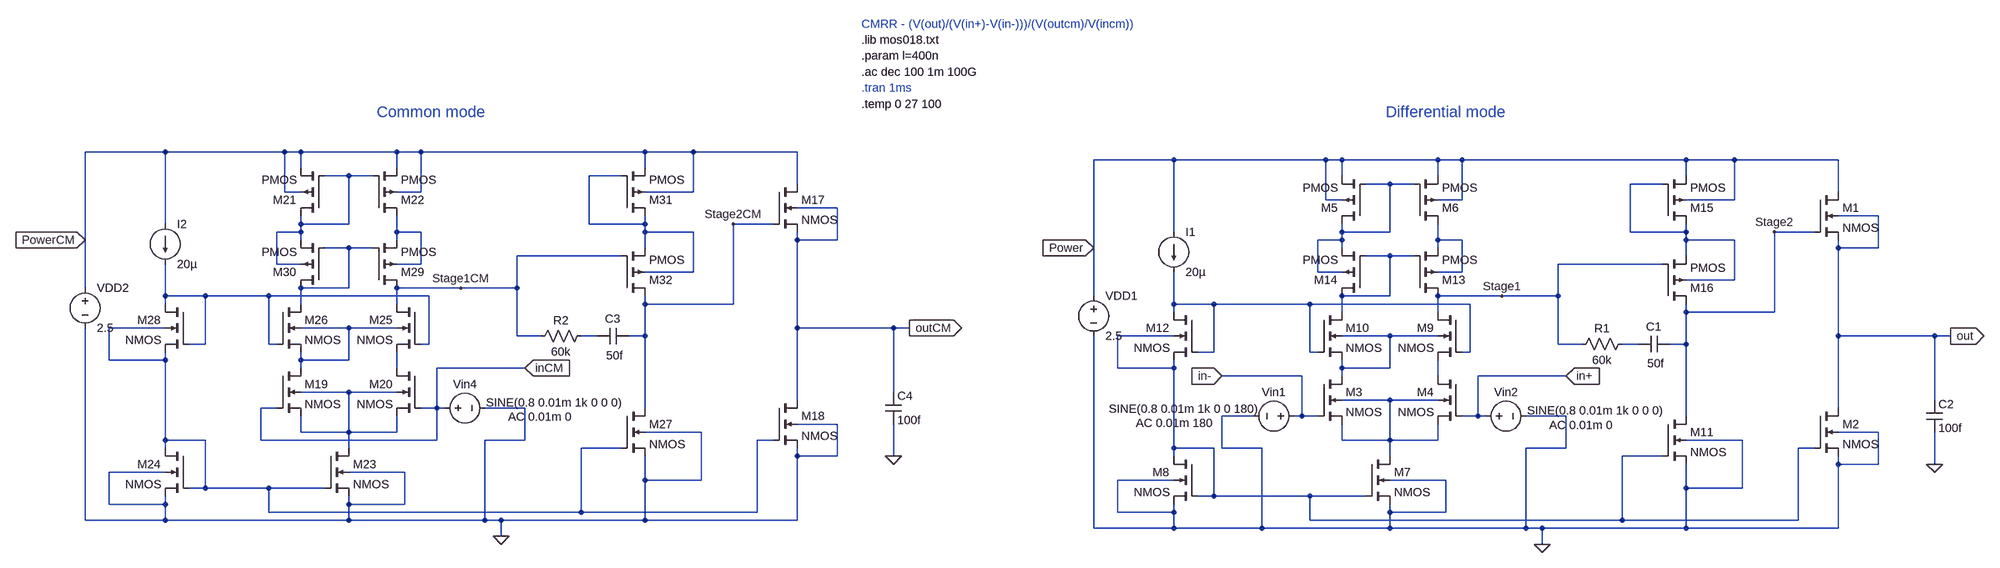
[diagram p0: schematic CMRR.asc]
CMRR.asc, the LTspice schematic file:
Version 4
SHEET 1 1324 1444
WIRE -2576 -240 -2736 -240
WIRE -2272 -240 -2576 -240
WIRE -2240 -240 -2272 -240
WIRE -2048 -240 -2240 -240
WIRE -2000 -240 -2048 -240
WIRE -1552 -240 -2000 -240
WIRE -1456 -240 -1552 -240
WIRE -1248 -240 -1456 -240
WIRE -496 -224 -656 -224
WIRE -192 -224 -496 -224
WIRE -160 -224 -192 -224
WIRE 32 -224 -160 -224
WIRE 80 -224 32 -224
WIRE 528 -224 80 -224
WIRE 624 -224 528 -224
WIRE 832 -224 624 -224
WIRE -2240 -208 -2240 -240
WIRE -2048 -208 -2048 -240
WIRE -1552 -208 -1552 -240
WIRE -2144 -192 -2192 -192
WIRE -2096 -192 -2144 -192
WIRE -1600 -192 -1664 -192
WIRE -160 -192 -160 -224
WIRE 32 -192 32 -224
WIRE 528 -192 528 -224
WIRE -1248 -176 -1248 -240
WIRE -64 -176 -112 -176
WIRE -16 -176 -64 -176
WIRE 480 -176 416 -176
WIRE -2272 -160 -2272 -240
WIRE -2240 -160 -2272 -160
WIRE -2000 -160 -2000 -240
WIRE -2000 -160 -2048 -160
WIRE -1456 -160 -1456 -240
WIRE -1456 -160 -1552 -160
WIRE 832 -160 832 -224
WIRE -192 -144 -192 -224
WIRE -160 -144 -192 -144
WIRE 80 -144 80 -224
WIRE 80 -144 32 -144
WIRE 624 -144 624 -224
WIRE 624 -144 528 -144
WIRE -1168 -128 -1248 -128
WIRE 912 -112 832 -112
WIRE -2576 -96 -2576 -240
WIRE -2240 -96 -2240 -112
WIRE -2144 -96 -2144 -192
WIRE -2144 -96 -2240 -96
WIRE -1664 -96 -1664 -192
WIRE -1552 -96 -1552 -112
WIRE -1552 -96 -1664 -96
WIRE -1296 -96 -1376 -96
WIRE -2240 -80 -2240 -96
WIRE -2240 -80 -2288 -80
WIRE -2048 -80 -2048 -112
WIRE -2000 -80 -2048 -80
WIRE -1552 -80 -1552 -96
WIRE -1456 -80 -1552 -80
WIRE -496 -80 -496 -224
WIRE -160 -80 -160 -96
WIRE -64 -80 -64 -176
WIRE -64 -80 -160 -80
WIRE 416 -80 416 -176
WIRE 528 -80 528 -96
WIRE 528 -80 416 -80
WIRE 784 -80 704 -80
WIRE -2736 -64 -2736 -240
WIRE -2240 -64 -2240 -80
WIRE -2048 -64 -2048 -80
WIRE -1248 -64 -1248 -80
WIRE -1168 -64 -1168 -128
WIRE -1168 -64 -1248 -64
WIRE -160 -64 -160 -80
WIRE -160 -64 -208 -64
WIRE 32 -64 32 -96
WIRE 80 -64 32 -64
WIRE 528 -64 528 -80
WIRE 624 -64 528 -64
WIRE -2144 -48 -2192 -48
WIRE -2096 -48 -2144 -48
WIRE -1552 -48 -1552 -80
WIRE -656 -48 -656 -224
WIRE -160 -48 -160 -64
WIRE 32 -48 32 -64
WIRE 832 -48 832 -64
WIRE 912 -48 912 -112
WIRE 912 -48 832 -48
WIRE -1600 -32 -1808 -32
WIRE -64 -32 -112 -32
WIRE -16 -32 -64 -32
WIRE 528 -32 528 -64
WIRE -2288 -16 -2288 -80
WIRE -2240 -16 -2288 -16
WIRE -2000 -16 -2000 -80
WIRE -2000 -16 -2048 -16
WIRE 480 -16 272 -16
WIRE -1456 0 -1456 -80
WIRE -1456 0 -1552 0
WIRE -208 0 -208 -64
WIRE -160 0 -208 0
WIRE 80 0 80 -64
WIRE 80 0 32 0
WIRE 624 16 624 -64
WIRE 624 16 528 16
WIRE -2736 32 -2736 -64
WIRE -2144 32 -2144 -48
WIRE -2144 32 -2240 32
WIRE -1920 32 -2048 32
WIRE -1808 32 -1808 -32
WIRE -1808 32 -1920 32
WIRE -2576 48 -2576 -16
WIRE -2496 48 -2576 48
WIRE -2304 48 -2496 48
WIRE -1984 48 -2304 48
WIRE -656 48 -656 -48
WIRE -64 48 -64 -32
WIRE -64 48 -160 48
WIRE 160 48 32 48
WIRE 272 48 272 -16
WIRE 272 48 160 48
WIRE -2576 64 -2576 48
WIRE -2240 64 -2240 32
WIRE -2048 64 -2048 32
WIRE -1552 64 -1552 48
WIRE -1376 64 -1376 -96
WIRE -1376 64 -1552 64
WIRE -496 64 -496 0
WIRE -416 64 -496 64
WIRE -224 64 -416 64
WIRE 96 64 -224 64
WIRE -496 80 -496 64
WIRE -160 80 -160 48
WIRE 32 80 32 48
WIRE 528 80 528 64
WIRE 704 80 704 -80
WIRE 704 80 528 80
WIRE -2576 112 -2688 112
WIRE -2144 112 -2240 112
WIRE -2048 112 -2144 112
WIRE -1248 112 -1248 -64
WIRE -1056 112 -1248 112
WIRE -1024 112 -1056 112
WIRE -1808 128 -1808 32
WIRE -1760 128 -1808 128
WIRE -1648 128 -1680 128
WIRE -1552 128 -1552 64
WIRE -1552 128 -1584 128
WIRE -496 128 -608 128
WIRE -64 128 -160 128
WIRE 32 128 -64 128
WIRE 832 128 832 -48
WIRE 1024 128 832 128
WIRE 1056 128 1024 128
WIRE -2496 144 -2496 48
WIRE -2496 144 -2528 144
WIRE -2304 144 -2304 48
WIRE -2288 144 -2304 144
WIRE -1984 144 -1984 48
WIRE -1984 144 -2000 144
WIRE 272 144 272 48
WIRE 320 144 272 144
WIRE 432 144 400 144
WIRE 528 144 528 80
WIRE 528 144 496 144
WIRE -416 160 -416 64
WIRE -416 160 -448 160
WIRE -224 160 -224 64
WIRE -208 160 -224 160
WIRE 96 160 96 64
WIRE 96 160 80 160
WIRE -2688 176 -2688 112
WIRE -2576 176 -2576 160
WIRE -2576 176 -2688 176
WIRE -2240 176 -2240 160
WIRE -2144 176 -2144 112
WIRE -2144 176 -2240 176
WIRE -2240 192 -2240 176
WIRE -2048 192 -2048 160
WIRE -1792 192 -1968 192
WIRE -608 192 -608 128
WIRE -496 192 -496 176
WIRE -496 192 -608 192
WIRE -160 192 -160 176
WIRE -64 192 -64 128
WIRE -64 192 -160 192
WIRE -240 208 -400 208
WIRE -160 208 -160 192
WIRE 32 208 32 176
WIRE 288 208 112 208
WIRE -2144 240 -2240 240
WIRE -2048 240 -2144 240
WIRE -1056 240 -1056 112
WIRE -1248 256 -1248 112
WIRE -64 256 -160 256
WIRE 32 256 -64 256
WIRE 1024 256 1024 128
WIRE -2288 272 -2320 272
WIRE -1968 272 -1968 192
WIRE -1968 272 -2000 272
WIRE -1952 272 -1968 272
WIRE -1792 272 -1872 272
WIRE -1552 272 -1552 128
WIRE 832 272 832 128
WIRE -336 288 -400 288
WIRE -240 288 -240 208
WIRE -240 288 -256 288
WIRE -208 288 -240 288
WIRE 112 288 112 208
WIRE 112 288 80 288
WIRE 128 288 112 288
WIRE 288 288 208 288
WIRE 528 288 528 144
WIRE -1168 304 -1248 304
WIRE -2240 320 -2240 288
WIRE -2144 320 -2144 240
WIRE -2144 320 -2240 320
WIRE -2048 320 -2048 288
WIRE -2048 320 -2144 320
WIRE -1440 320 -1552 320
WIRE 912 320 832 320
WIRE -2576 336 -2576 176
WIRE -2496 336 -2576 336
WIRE -2320 336 -2320 272
WIRE -1968 336 -1968 272
WIRE -1968 336 -2320 336
WIRE -1792 336 -1792 272
WIRE -1792 336 -1872 336
WIRE -1296 336 -1328 336
WIRE -160 336 -160 304
WIRE -64 336 -64 256
WIRE -64 336 -160 336
WIRE 32 336 32 304
WIRE 32 336 -64 336
WIRE 640 336 528 336
WIRE -2576 352 -2576 336
WIRE -2144 352 -2144 320
WIRE -1600 352 -1680 352
WIRE -496 352 -496 192
WIRE -416 352 -496 352
WIRE -400 352 -400 288
WIRE -320 352 -400 352
WIRE 288 352 288 288
WIRE 288 352 208 352
WIRE 784 352 752 352
WIRE -1248 368 -1248 352
WIRE -1168 368 -1168 304
WIRE -1168 368 -1248 368
WIRE -1056 368 -1056 304
WIRE -496 368 -496 352
WIRE -64 368 -64 336
WIRE 480 368 400 368
WIRE 832 384 832 368
WIRE 912 384 912 320
WIRE 912 384 832 384
WIRE 1024 384 1024 320
WIRE -2576 400 -2688 400
WIRE -2032 400 -2144 400
WIRE -1552 416 -1552 368
WIRE -1440 416 -1440 320
WIRE -1440 416 -1552 416
WIRE -496 416 -608 416
WIRE 48 416 -64 416
WIRE -2496 432 -2496 336
WIRE -2496 432 -2528 432
WIRE -2304 432 -2496 432
WIRE -2192 432 -2304 432
WIRE 528 432 528 384
WIRE 640 432 640 336
WIRE 640 432 528 432
WIRE -416 448 -416 352
WIRE -416 448 -448 448
WIRE -224 448 -416 448
WIRE -112 448 -224 448
WIRE -2688 464 -2688 400
WIRE -2576 464 -2576 448
WIRE -2576 464 -2688 464
WIRE -2144 464 -2144 448
WIRE -2032 464 -2032 400
WIRE -2032 464 -2144 464
WIRE -2304 480 -2304 432
WIRE -1680 480 -1680 352
WIRE -1680 480 -2304 480
WIRE -1328 480 -1328 336
WIRE -1328 480 -1680 480
WIRE -608 480 -608 416
WIRE -496 480 -496 464
WIRE -496 480 -608 480
WIRE -64 480 -64 464
WIRE 48 480 48 416
WIRE 48 480 -64 480
WIRE -2736 496 -2736 112
WIRE -2576 496 -2576 464
WIRE -2576 496 -2736 496
WIRE -2144 496 -2144 464
WIRE -2144 496 -2576 496
WIRE -1872 496 -1872 336
WIRE -1872 496 -2144 496
WIRE -1840 496 -1872 496
WIRE -1552 496 -1552 416
WIRE -1552 496 -1840 496
WIRE -1248 496 -1248 368
WIRE -1248 496 -1552 496
WIRE -224 496 -224 448
WIRE 400 496 400 368
WIRE 400 496 -224 496
WIRE 752 496 752 352
WIRE 752 496 400 496
WIRE -656 512 -656 128
WIRE -496 512 -496 480
WIRE -496 512 -656 512
WIRE -320 512 -320 352
WIRE -320 512 -496 512
WIRE -64 512 -64 480
WIRE -64 512 -320 512
WIRE 208 512 208 352
WIRE 208 512 -64 512
WIRE 240 512 208 512
WIRE 528 512 528 432
WIRE 528 512 240 512
WIRE 832 512 832 384
WIRE 832 512 528 512
WIRE -1840 528 -1840 496
WIRE 240 544 240 512
FLAG 1056 128 out
IOPIN 1056 128 Out
FLAG 240 544 0
FLAG 288 208 in+
IOPIN 288 208 In
FLAG -400 208 in-
IOPIN -400 208 In
FLAG 160 48 Stage1
FLAG 704 -80 Stage2
FLAG -656 -48 Power
IOPIN -656 -48 In
FLAG 1024 384 0
FLAG -1024 112 outCM
IOPIN -1024 112 Out
FLAG -1840 528 0
FLAG -1792 192 inCM
IOPIN -1792 192 In
FLAG -1920 32 Stage1CM
FLAG -1376 -96 Stage2CM
FLAG -2736 -64 PowerCM
IOPIN -2736 -64 In
FLAG -1056 368 0
SYMBOL nmos4 784 -160 R0
SYMATTR InstName M1
SYMATTR Value2 l={l} w=0.5u m=20
SYMBOL nmos4 784 272 R0
SYMATTR InstName M2
SYMATTR Value2 l={l} w=10u m=3
SYMBOL nmos4 -208 208 R0
SYMATTR InstName M3
SYMATTR Value2 l={l} w=0.5u m=1
SYMBOL nmos4 80 208 M0
SYMATTR InstName M4
SYMATTR Value2 l={l} w=0.5u m=1
SYMBOL pmos4 -112 -96 R180
SYMATTR InstName M5
SYMATTR Value2 l={l} w=1u m=2
SYMBOL pmos4 -16 -96 M180
SYMATTR InstName M6
SYMATTR Value2 l={l} w=1u m=2
SYMBOL nmos4 -112 368 R0
SYMATTR InstName M7
SYMATTR Value2 l={l} w=2u
SYMBOL current -496 -80 R0
WINDOW 123 0 0 Left 0
WINDOW 39 0 0 Left 0
SYMATTR InstName I1
SYMATTR Value 20µ
SYMBOL nmos4 -448 368 M0
SYMATTR InstName M8
SYMATTR Value2 l={l} w=10u
SYMBOL voltage -656 32 R0
WINDOW 123 0 0 Left 0
WINDOW 39 0 0 Left 0
SYMATTR InstName VDD1
SYMATTR Value 2.5
SYMBOL voltage -240 288 R90
WINDOW 0 -32 56 VBottom 2
WINDOW 3 -30 236 VTop 2
WINDOW 123 -2 254 VTop 2
WINDOW 39 -2 236 VTop 2
SYMATTR InstName Vin1
SYMATTR Value SINE(0.8 0.01m 1k 0 0 180)
SYMATTR Value2 AC 0.01m 180
SYMBOL voltage 112 288 R270
WINDOW 0 32 56 VTop 2
WINDOW 3 27 235 VBottom 2
WINDOW 123 -2 206 VBottom 2
WINDOW 39 -1 235 VBottom 2
SYMATTR InstName Vin2
SYMATTR Value SINE(0.8 0.01m 1k 0 0 0)
SYMATTR Value2 AC 0.01m 0
SYMBOL nmos4 80 80 M0
SYMATTR InstName M9
SYMATTR Value2 l={l} w=0.5u m=1
SYMBOL nmos4 -208 80 R0
SYMATTR InstName M10
SYMATTR Value2 l={l} w=0.5u m=1
SYMBOL nmos4 480 288 R0
SYMATTR InstName M11
SYMATTR Value2 l={l} w=1u m=5
SYMBOL cap 496 128 R90
WINDOW 0 -3 33 VBottom 2
WINDOW 3 39 29 VTop 2
SYMATTR InstName C1
SYMATTR Value 50f
SYMBOL nmos4 -448 80 M0
SYMATTR InstName M12
SYMATTR Value2 l={l} w=1u
SYMBOL pmos4 -16 48 M180
SYMATTR InstName M13
SYMATTR Value2 l={l} w=1u m=1
SYMBOL pmos4 -112 48 R180
SYMATTR InstName M14
SYMATTR Value2 l={l} w=1u m=1
SYMBOL pmos4 480 -96 M180
SYMATTR InstName M15
SYMATTR Value2 l={l} w=0.5u m=25
SYMBOL pmos4 480 64 M180
SYMATTR InstName M16
SYMATTR Value2 l={l} w=0.5u m=10
SYMBOL res 416 128 R90
WINDOW 0 0 56 VBottom 2
WINDOW 3 32 56 VTop 2
SYMATTR InstName R1
SYMATTR Value 60k
SYMBOL cap 1008 256 R0
SYMATTR InstName C2
SYMATTR Value 100f
SYMBOL nmos4 -1296 -176 R0
SYMATTR InstName M17
SYMATTR Value2 l={l} w=0.5u m=20
SYMBOL nmos4 -1296 256 R0
SYMATTR InstName M18
SYMATTR Value2 l={l} w=10u m=3
SYMBOL nmos4 -2288 192 R0
SYMATTR InstName M19
SYMATTR Value2 l={l} w=0.5u m=1
SYMBOL nmos4 -2000 192 M0
SYMATTR InstName M20
SYMATTR Value2 l={l} w=0.5u m=1
SYMBOL pmos4 -2192 -112 R180
SYMATTR InstName M21
SYMATTR Value2 l={l} w=1u m=2
SYMBOL pmos4 -2096 -112 M180
SYMATTR InstName M22
SYMATTR Value2 l={l} w=1u m=2
SYMBOL nmos4 -2192 352 R0
SYMATTR InstName M23
SYMATTR Value2 l={l} w=2u
SYMBOL current -2576 -96 R0
WINDOW 123 0 0 Left 0
WINDOW 39 0 0 Left 0
SYMATTR InstName I2
SYMATTR Value 20µ
SYMBOL nmos4 -2528 352 M0
SYMATTR InstName M24
SYMATTR Value2 l={l} w=10u
SYMBOL voltage -2736 16 R0
WINDOW 123 0 0 Left 0
WINDOW 39 0 0 Left 0
SYMATTR InstName VDD2
SYMATTR Value 2.5
SYMBOL voltage -1968 272 R270
WINDOW 0 32 56 VTop 2
WINDOW 3 27 235 VBottom 2
WINDOW 123 -2 206 VBottom 2
WINDOW 39 -1 235 VBottom 2
SYMATTR InstName Vin4
SYMATTR Value SINE(0.8 0.01m 1k 0 0 0)
SYMATTR Value2 AC 0.01m 0
SYMBOL nmos4 -2000 64 M0
SYMATTR InstName M25
SYMATTR Value2 l={l} w=0.5u m=1
SYMBOL nmos4 -2288 64 R0
SYMATTR InstName M26
SYMATTR Value2 l={l} w=0.5u m=1
SYMBOL nmos4 -1600 272 R0
SYMATTR InstName M27
SYMATTR Value2 l={l} w=1u m=5
SYMBOL cap -1584 112 R90
WINDOW 0 -3 33 VBottom 2
WINDOW 3 39 29 VTop 2
SYMATTR InstName C3
SYMATTR Value 50f
SYMBOL nmos4 -2528 64 M0
SYMATTR InstName M28
SYMATTR Value2 l={l} w=1u
SYMBOL pmos4 -2096 32 M180
SYMATTR InstName M29
SYMATTR Value2 l={l} w=1u m=1
SYMBOL pmos4 -2192 32 R180
SYMATTR InstName M30
SYMATTR Value2 l={l} w=1u m=1
SYMBOL pmos4 -1600 -112 M180
SYMATTR InstName M31
SYMATTR Value2 l={l} w=0.5u m=25
SYMBOL pmos4 -1600 48 M180
SYMATTR InstName M32
SYMATTR Value2 l={l} w=0.5u m=10
SYMBOL res -1664 112 R90
WINDOW 0 0 56 VBottom 2
WINDOW 3 32 56 VTop 2
SYMATTR InstName R2
SYMATTR Value 60k
SYMBOL cap -1072 240 R0
SYMATTR InstName C4
SYMATTR Value 100f
TEXT -1120 -368 Left 2 ;.tran 1ms
TEXT -1120 -336 Left 2 !.temp 0 27 100
TEXT -1120 -400 Left 2 !.ac dec 100 1m 100G
TEXT -1120 -432 Left 2 !.param l=400n
TEXT -1120 -464 Left 2 !.lib mos018.txt
TEXT -1120 -496 Left 2 ;CMRR - (V(out)/(V(in+)-V(in-)))/(V(outcm)/V(incm))
TEXT -72 -320 Left 3 ;Differential mode
TEXT -2088 -320 Left 3 ;Common mode

The netlist it stands for:
* CMRR.asc
M1 Power Stage2 out out NMOS l={l} w=0.5u m=20
M2 out N014 0 0 NMOS l={l} w=10u m=3
M3 N015 in- N020 N020 NMOS l={l} w=0.5u m=1
M4 N018 in+ N020 N020 NMOS l={l} w=0.5u m=1
M5 N003 N003 Power Power PMOS l={l} w=1u m=2
M6 N006 N003 Power Power PMOS l={l} w=1u m=2
M7 N020 N014 0 0 NMOS l={l} w=2u
I1 Power N010 20µ
M8 N014 N014 0 0 NMOS l={l} w=10u
VDD1 Power 0 2.5
Vin1 in- 0 SINE(0.8 0.01m 1k 0 0 180) AC 0.01m 180
Vin2 in+ 0 SINE(0.8 0.01m 1k 0 0 0) AC 0.01m 0
M9 Stage1 N010 N018 N015 NMOS l={l} w=0.5u m=1
M10 N008 N010 N015 N015 NMOS l={l} w=0.5u m=1
M11 Stage2 N014 0 0 NMOS l={l} w=1u m=5
C1 Stage2 N016 50f
M12 N010 N010 N014 N014 NMOS l={l} w=1u
M13 Stage1 N008 N006 N006 PMOS l={l} w=1u m=1
M14 N008 N008 N003 N003 PMOS l={l} w=1u m=1
M15 N004 N004 Power Power PMOS l={l} w=0.5u m=25
M16 Stage2 Stage1 N004 N004 PMOS l={l} w=0.5u m=10
R1 N016 Stage1 60k
C2 out 0 100f
M17 PowerCM Stage2CM outCM outCM NMOS l={l} w=0.5u m=20
M18 outCM N011 0 0 NMOS l={l} w=10u m=3
M19 N012 inCM N019 N019 NMOS l={l} w=0.5u m=1
M20 N017 inCM N019 N019 NMOS l={l} w=0.5u m=1
M21 N001 N001 PowerCM PowerCM PMOS l={l} w=1u m=2
M22 N005 N001 PowerCM PowerCM PMOS l={l} w=1u m=2
M23 N019 N011 0 0 NMOS l={l} w=2u
I2 PowerCM N009 20µ
M24 N011 N011 0 0 NMOS l={l} w=10u
VDD2 PowerCM 0 2.5
Vin4 inCM 0 SINE(0.8 0.01m 1k 0 0 0) AC 0.01m 0
M25 Stage1CM N009 N017 N012 NMOS l={l} w=0.5u m=1
M26 N007 N009 N012 N012 NMOS l={l} w=0.5u m=1
M27 Stage2CM N011 0 0 NMOS l={l} w=1u m=5
C3 Stage2CM N013 50f
M28 N009 N009 N011 N011 NMOS l={l} w=1u
M29 Stage1CM N007 N005 N005 PMOS l={l} w=1u m=1
M30 N007 N007 N001 N001 PMOS l={l} w=1u m=1
M31 N002 N002 PowerCM PowerCM PMOS l={l} w=0.5u m=25
M32 Stage2CM Stage1CM N002 N002 PMOS l={l} w=0.5u m=10
R2 N013 Stage1CM 60k
C4 outCM 0 100f
.model NMOS NMOS
.model PMOS PMOS
.lib standard.mos
* .tran 1ms
.temp 0 27 100
.ac dec 100 1m 100G
.param l=400n
.lib mos018.txt
* CMRR - (V(out)/(V(in+)-V(in-)))/(V(outcm)/V(incm))
* Differential mode
* Common mode
.backanno
.end